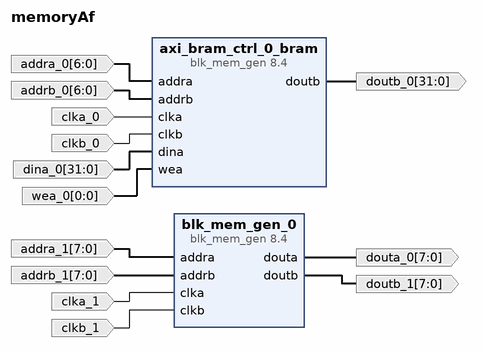
[diagram p0: block diagram of the top level]
# Vivado block design memoryAf, xc7z010clg400-1, Vivado 2023.1
create_bd_design memoryAf

create_bd_port -dir I -type clk clka_0
create_bd_port -dir I -type clk clkb_0
create_bd_port -dir I -type clk clka_1
create_bd_port -dir I -type clk clkb_1
create_bd_port -dir I -from 7 -to 0 addrb_1
create_bd_port -dir O -from 7 -to 0 douta_0
create_bd_port -dir O -from 31 -to 0 doutb_0
create_bd_port -dir O -from 7 -to 0 doutb_1
create_bd_port -dir I -from 31 -to 0 dina_0
create_bd_port -dir I -from 6 -to 0 addrb_0
create_bd_port -dir I -from 0 -to 0 wea_0
create_bd_port -dir I -from 6 -to 0 addra_0
create_bd_port -dir I -from 7 -to 0 addra_1

create_bd_cell -type ip -vlnv xilinx.com:ip:blk_mem_gen:8.4 axi_bram_ctrl_0_bram
set_property -dict [list \
  CONFIG.Assume_Synchronous_Clk true \
  CONFIG.Coe_File load_ram.coe \
  CONFIG.Enable_32bit_Address false \
  CONFIG.Enable_A Always_Enabled \
  CONFIG.Enable_B Always_Enabled \
  CONFIG.Load_Init_File true \
  CONFIG.Memory_Type Simple_Dual_Port_RAM \
  CONFIG.Use_Byte_Write_Enable false \
  CONFIG.Write_Depth_A 128 \
  CONFIG.Write_Width_A 32 \
  CONFIG.Write_Width_B 32 \
  CONFIG.use_bram_block Stand_Alone \
] [get_bd_cells axi_bram_ctrl_0_bram]
create_bd_cell -type ip -vlnv xilinx.com:ip:blk_mem_gen:8.4 blk_mem_gen_0
set_property -dict [list \
  CONFIG.Assume_Synchronous_Clk true \
  CONFIG.Coe_File rom_loader.coe \
  CONFIG.Disable_Out_of_Range_Warnings false \
  CONFIG.Enable_32bit_Address false \
  CONFIG.Enable_A Always_Enabled \
  CONFIG.Enable_B Always_Enabled \
  CONFIG.Fill_Remaining_Memory_Locations false \
  CONFIG.Load_Init_File true \
  CONFIG.Memory_Type Dual_Port_ROM \
  CONFIG.Register_PortA_Output_of_Memory_Core false \
  CONFIG.Register_PortA_Output_of_Memory_Primitives false \
  CONFIG.Register_PortB_Output_of_Memory_Primitives false \
  CONFIG.Use_RSTA_Pin false \
  CONFIG.Use_RSTB_Pin false \
  CONFIG.Write_Depth_A 256 \
  CONFIG.Write_Width_A 8 \
  CONFIG.use_bram_block Stand_Alone \
] [get_bd_cells blk_mem_gen_0]

# ---- connections ----

connect_bd_net -net addra_0_1 [get_bd_ports addra_0] [get_bd_pins axi_bram_ctrl_0_bram/addra]
connect_bd_net -net addra_1_1 [get_bd_ports addra_1] [get_bd_pins blk_mem_gen_0/addra]
connect_bd_net -net addrb_0_1 [get_bd_ports addrb_0] [get_bd_pins axi_bram_ctrl_0_bram/addrb]
connect_bd_net -net addrb_1_1 [get_bd_ports addrb_1] [get_bd_pins blk_mem_gen_0/addrb]
connect_bd_net [get_bd_pins axi_bram_ctrl_0_bram/doutb] [get_bd_ports doutb_0]
connect_bd_net [get_bd_pins blk_mem_gen_0/douta] [get_bd_ports douta_0]
connect_bd_net [get_bd_pins blk_mem_gen_0/doutb] [get_bd_ports doutb_1]
connect_bd_net -net clka_0_1 [get_bd_ports clka_0] [get_bd_pins axi_bram_ctrl_0_bram/clka]
connect_bd_net -net clka_1_1 [get_bd_ports clka_1] [get_bd_pins blk_mem_gen_0/clka]
connect_bd_net -net clkb_0_1 [get_bd_ports clkb_0] [get_bd_pins axi_bram_ctrl_0_bram/clkb]
connect_bd_net -net clkb_1_1 [get_bd_ports clkb_1] [get_bd_pins blk_mem_gen_0/clkb]
connect_bd_net -net dina_0_1 [get_bd_ports dina_0] [get_bd_pins axi_bram_ctrl_0_bram/dina]
connect_bd_net -net wea_0_1 [get_bd_ports wea_0] [get_bd_pins axi_bram_ctrl_0_bram/wea]

validate_bd_design
save_bd_design
